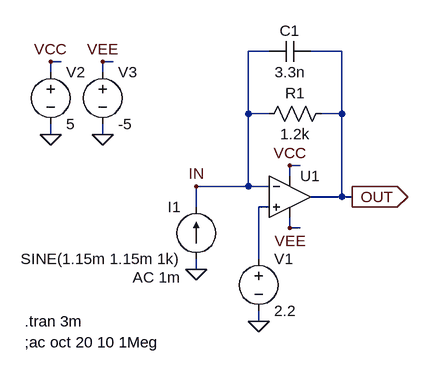
[diagram p0: schematic TDA1543_I-V_Convert.asc]
TDA1543_I-V_Convert.asc, the LTspice schematic file:
Version 4
SHEET 1 880 680
WIRE 288 -144 256 -144
WIRE 400 -144 352 -144
WIRE -32 -128 -48 -128
WIRE 48 -128 32 -128
WIRE -48 -112 -48 -128
WIRE 32 -112 32 -128
WIRE 256 -48 256 -144
WIRE 288 -48 256 -48
WIRE 400 -48 400 -144
WIRE 400 -48 368 -48
WIRE -48 -16 -48 -32
WIRE 32 -16 32 -32
WIRE 336 32 320 32
WIRE 320 48 320 32
WIRE 256 64 256 -48
WIRE 256 64 176 64
WIRE 288 64 256 64
WIRE 400 80 400 -48
WIRE 400 80 352 80
WIRE 416 80 400 80
WIRE 176 96 176 64
WIRE 288 96 272 96
WIRE 320 128 320 112
WIRE 336 128 320 128
WIRE 272 176 272 96
WIRE 176 192 176 176
WIRE 272 272 272 256
FLAG 176 192 0
FLAG 272 272 0
FLAG 320 32 VCC
FLAG 320 128 VEE
FLAG 416 80 OUT
IOPIN 416 80 Out
FLAG 176 64 IN
FLAG -48 -16 0
FLAG 32 -16 0
FLAG -48 -128 VCC
FLAG 32 -128 VEE
SYMBOL current 176 176 R180
WINDOW 0 24 80 Left 2
WINDOW 3 24 0 Left 2
WINDOW 123 24 -28 Left 2
WINDOW 39 0 0 Left 2
SYMATTR InstName I1
SYMATTR Value SINE(1.15m 1.15m 1k)
SYMATTR Value2 AC 1m
SYMBOL Opamps\\UniversalOpamp2 320 80 R0
SYMATTR InstName U1
SYMBOL voltage 272 160 R0
WINDOW 123 0 0 Left 2
WINDOW 39 0 0 Left 2
SYMATTR InstName V1
SYMATTR Value 2.2
SYMBOL res 384 -64 R90
WINDOW 0 0 56 VBottom 2
WINDOW 3 32 56 VTop 2
SYMATTR InstName R1
SYMATTR Value 1.2k
SYMBOL cap 352 -160 R90
WINDOW 0 0 32 VBottom 2
WINDOW 3 32 32 VTop 2
SYMATTR InstName C1
SYMATTR Value 3.3n
SYMBOL voltage -48 -128 R0
WINDOW 123 0 0 Left 2
WINDOW 39 0 0 Left 2
SYMATTR InstName V2
SYMATTR Value 5
SYMBOL voltage 32 -128 R0
WINDOW 123 0 0 Left 2
WINDOW 39 0 0 Left 2
SYMATTR InstName V3
SYMATTR Value -5
TEXT -88 272 Left 2 !.tran 3m
TEXT -88 304 Left 2 !;ac oct 20 10 1Meg

The netlist it stands for:
* TDA1543_I-V_Convert.asc
I1 0 IN SINE(1.15m 1.15m 1k) AC 1m
XU1 N001 IN VCC VEE OUT level.2 Avol=1Meg GBW=10Meg Slew=10Meg ilimit=25m rail=0 Vos=0 phimargin=45 en=0 enk=0 in=0 ink=0 Rin=500Meg  ; pins IN+ IN- V+ V- OUT
V1 N001 0 2.2
R1 OUT IN 1.2k
C1 OUT IN 3.3n
V2 VCC 0 5
V3 VEE 0 -5
.tran 3m
;ac oct 20 10 1Meg
.lib UniversalOpamps2.sub
.backanno
.end